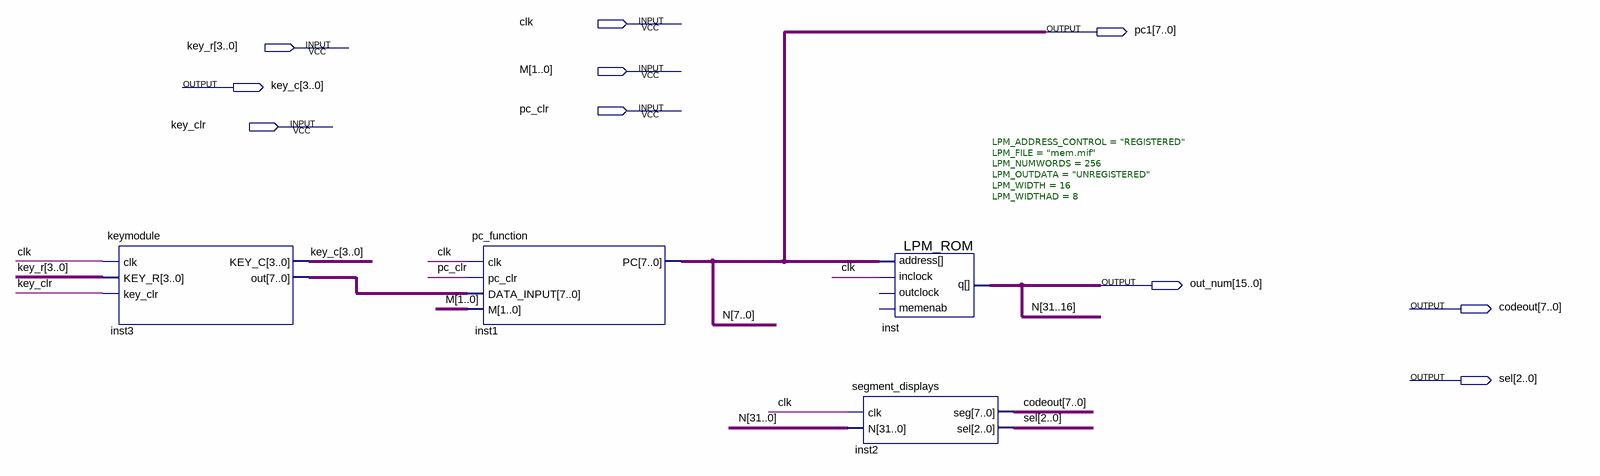
[diagram p0: schematic sheet]
// Quartus schematic exp7.bdf as structural Verilog: 4 symbols, 10 pins
module exp7 (
  input  clk,
  input  [3:0] key_r,
  input  [1:0] M,
  input  pc_clr,
  input  key_clr,
  output [7:0] pc1,
  output [3:0] key_c,
  output [15:0] out_num,
  output [7:0] codeout,
  output [2:0] sel
);

  wire [7:0] inst3_out;
  wire [15:8] N;

  keymodule inst3 (.clk(clk), .KEY_R(key_r), .key_clr(key_clr), .KEY_C(key_c), .out(inst3_out));
  pc_function inst1 (.clk(clk), .pc_clr(pc_clr), .DATA_INPUT(inst3_out), .M(M), .PC(pc1));
  segment_displays inst2 (.clk(clk), .N({out_num, N, pc1}), .seg(codeout), .sel(sel));
  LPM_ROM #(.LPM_ADDRESS_CONTROL("REGISTERED"), .LPM_FILE("mem.mif"), .LPM_NUMWORDS(256), .LPM_OUTDATA("UNREGISTERED"), .LPM_WIDTH(16), .LPM_WIDTHAD(8)) inst (
    .address(pc1), .inclock(clk), .q(out_num));  // open: outclock, memenab

  // Other names for the same wires on the sheet: N (some bits) = {out_num, pc1}
endmodule
